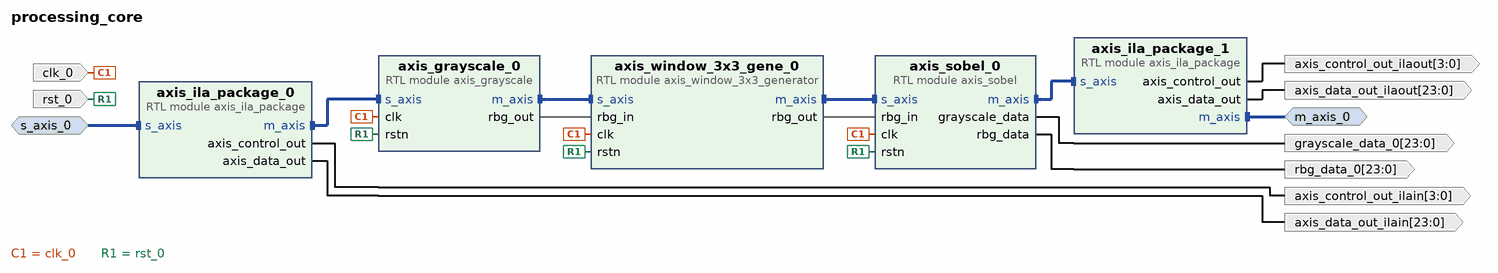
[diagram p0: block diagram of the top level]
# Vivado block design processing_core, xc7z020clg400-1, Vivado 2026.1
create_bd_design processing_core

create_bd_intf_port -mode Master -vlnv xilinx.com:interface:axis_rtl:1.0 m_axis_0
create_bd_intf_port -mode Slave -vlnv xilinx.com:interface:axis_rtl:1.0 s_axis_0
set_property -dict [list \
  CONFIG.HAS_TKEEP 0 \
  CONFIG.HAS_TLAST 1 \
  CONFIG.HAS_TREADY 1 \
  CONFIG.HAS_TSTRB 0 \
  CONFIG.LAYERED_METADATA undef \
  CONFIG.TDATA_NUM_BYTES 3 \
  CONFIG.TDEST_WIDTH 0 \
  CONFIG.TID_WIDTH 0 \
  CONFIG.TUSER_WIDTH 1 \
] [get_bd_intf_ports s_axis_0]
create_bd_port -dir I -type clk clk_0
create_bd_port -dir I -type rst rst_0
create_bd_port -dir O -from 23 -to 0 grayscale_data_0
create_bd_port -dir O -from 23 -to 0 rbg_data_0
create_bd_port -dir O -from 23 -to 0 axis_data_out_ilain
create_bd_port -dir O -from 3 -to 0 axis_control_out_ilain
create_bd_port -dir O -from 23 -to 0 axis_data_out_ilaout
create_bd_port -dir O -from 3 -to 0 axis_control_out_ilaout

create_bd_cell -type module -reference axis_grayscale axis_grayscale_0
create_bd_cell -type module -reference axis_window_3x3_generator axis_window_3x3_gene_0
create_bd_cell -type module -reference axis_sobel axis_sobel_0
create_bd_cell -type module -reference axis_ila_package axis_ila_package_0
create_bd_cell -type module -reference axis_ila_package axis_ila_package_1

# ---- connections ----

connect_bd_intf_net [get_bd_intf_pins axis_grayscale_0/m_axis] [get_bd_intf_pins axis_window_3x3_gene_0/s_axis]
connect_bd_intf_net [get_bd_intf_pins axis_ila_package_0/m_axis] [get_bd_intf_pins axis_grayscale_0/s_axis]
connect_bd_intf_net [get_bd_intf_ports m_axis_0] [get_bd_intf_pins axis_ila_package_1/m_axis]
connect_bd_intf_net [get_bd_intf_pins axis_ila_package_1/s_axis] [get_bd_intf_pins axis_sobel_0/m_axis]
connect_bd_intf_net [get_bd_intf_pins axis_window_3x3_gene_0/m_axis] [get_bd_intf_pins axis_sobel_0/s_axis]
connect_bd_intf_net -intf_net s_axis_0_1 [get_bd_intf_ports s_axis_0] [get_bd_intf_pins axis_ila_package_0/s_axis]
connect_bd_net [get_bd_pins axis_grayscale_0/rbg_out] [get_bd_pins axis_window_3x3_gene_0/rbg_in]
connect_bd_net [get_bd_pins axis_ila_package_0/axis_control_out] [get_bd_ports axis_control_out_ilain]
connect_bd_net [get_bd_pins axis_ila_package_0/axis_data_out] [get_bd_ports axis_data_out_ilain]
connect_bd_net [get_bd_pins axis_ila_package_1/axis_control_out] [get_bd_ports axis_control_out_ilaout]
connect_bd_net [get_bd_pins axis_ila_package_1/axis_data_out] [get_bd_ports axis_data_out_ilaout]
connect_bd_net [get_bd_pins axis_sobel_0/grayscale_data] [get_bd_ports grayscale_data_0]
connect_bd_net [get_bd_pins axis_sobel_0/rbg_data] [get_bd_ports rbg_data_0]
connect_bd_net [get_bd_pins axis_window_3x3_gene_0/rbg_out] [get_bd_pins axis_sobel_0/rbg_in]
connect_bd_net -net clk_0_1 [get_bd_ports clk_0] \
  [get_bd_pins axis_grayscale_0/clk] [get_bd_pins axis_sobel_0/clk] [get_bd_pins axis_window_3x3_gene_0/clk]
connect_bd_net -net rst_0_1 [get_bd_ports rst_0] \
  [get_bd_pins axis_grayscale_0/rstn] [get_bd_pins axis_window_3x3_gene_0/rstn] [get_bd_pins axis_sobel_0/rstn]

validate_bd_design
save_bd_design
